# Altium schematic sheet Schema_2021-10-31.schdoc
size 344 x 344 mm
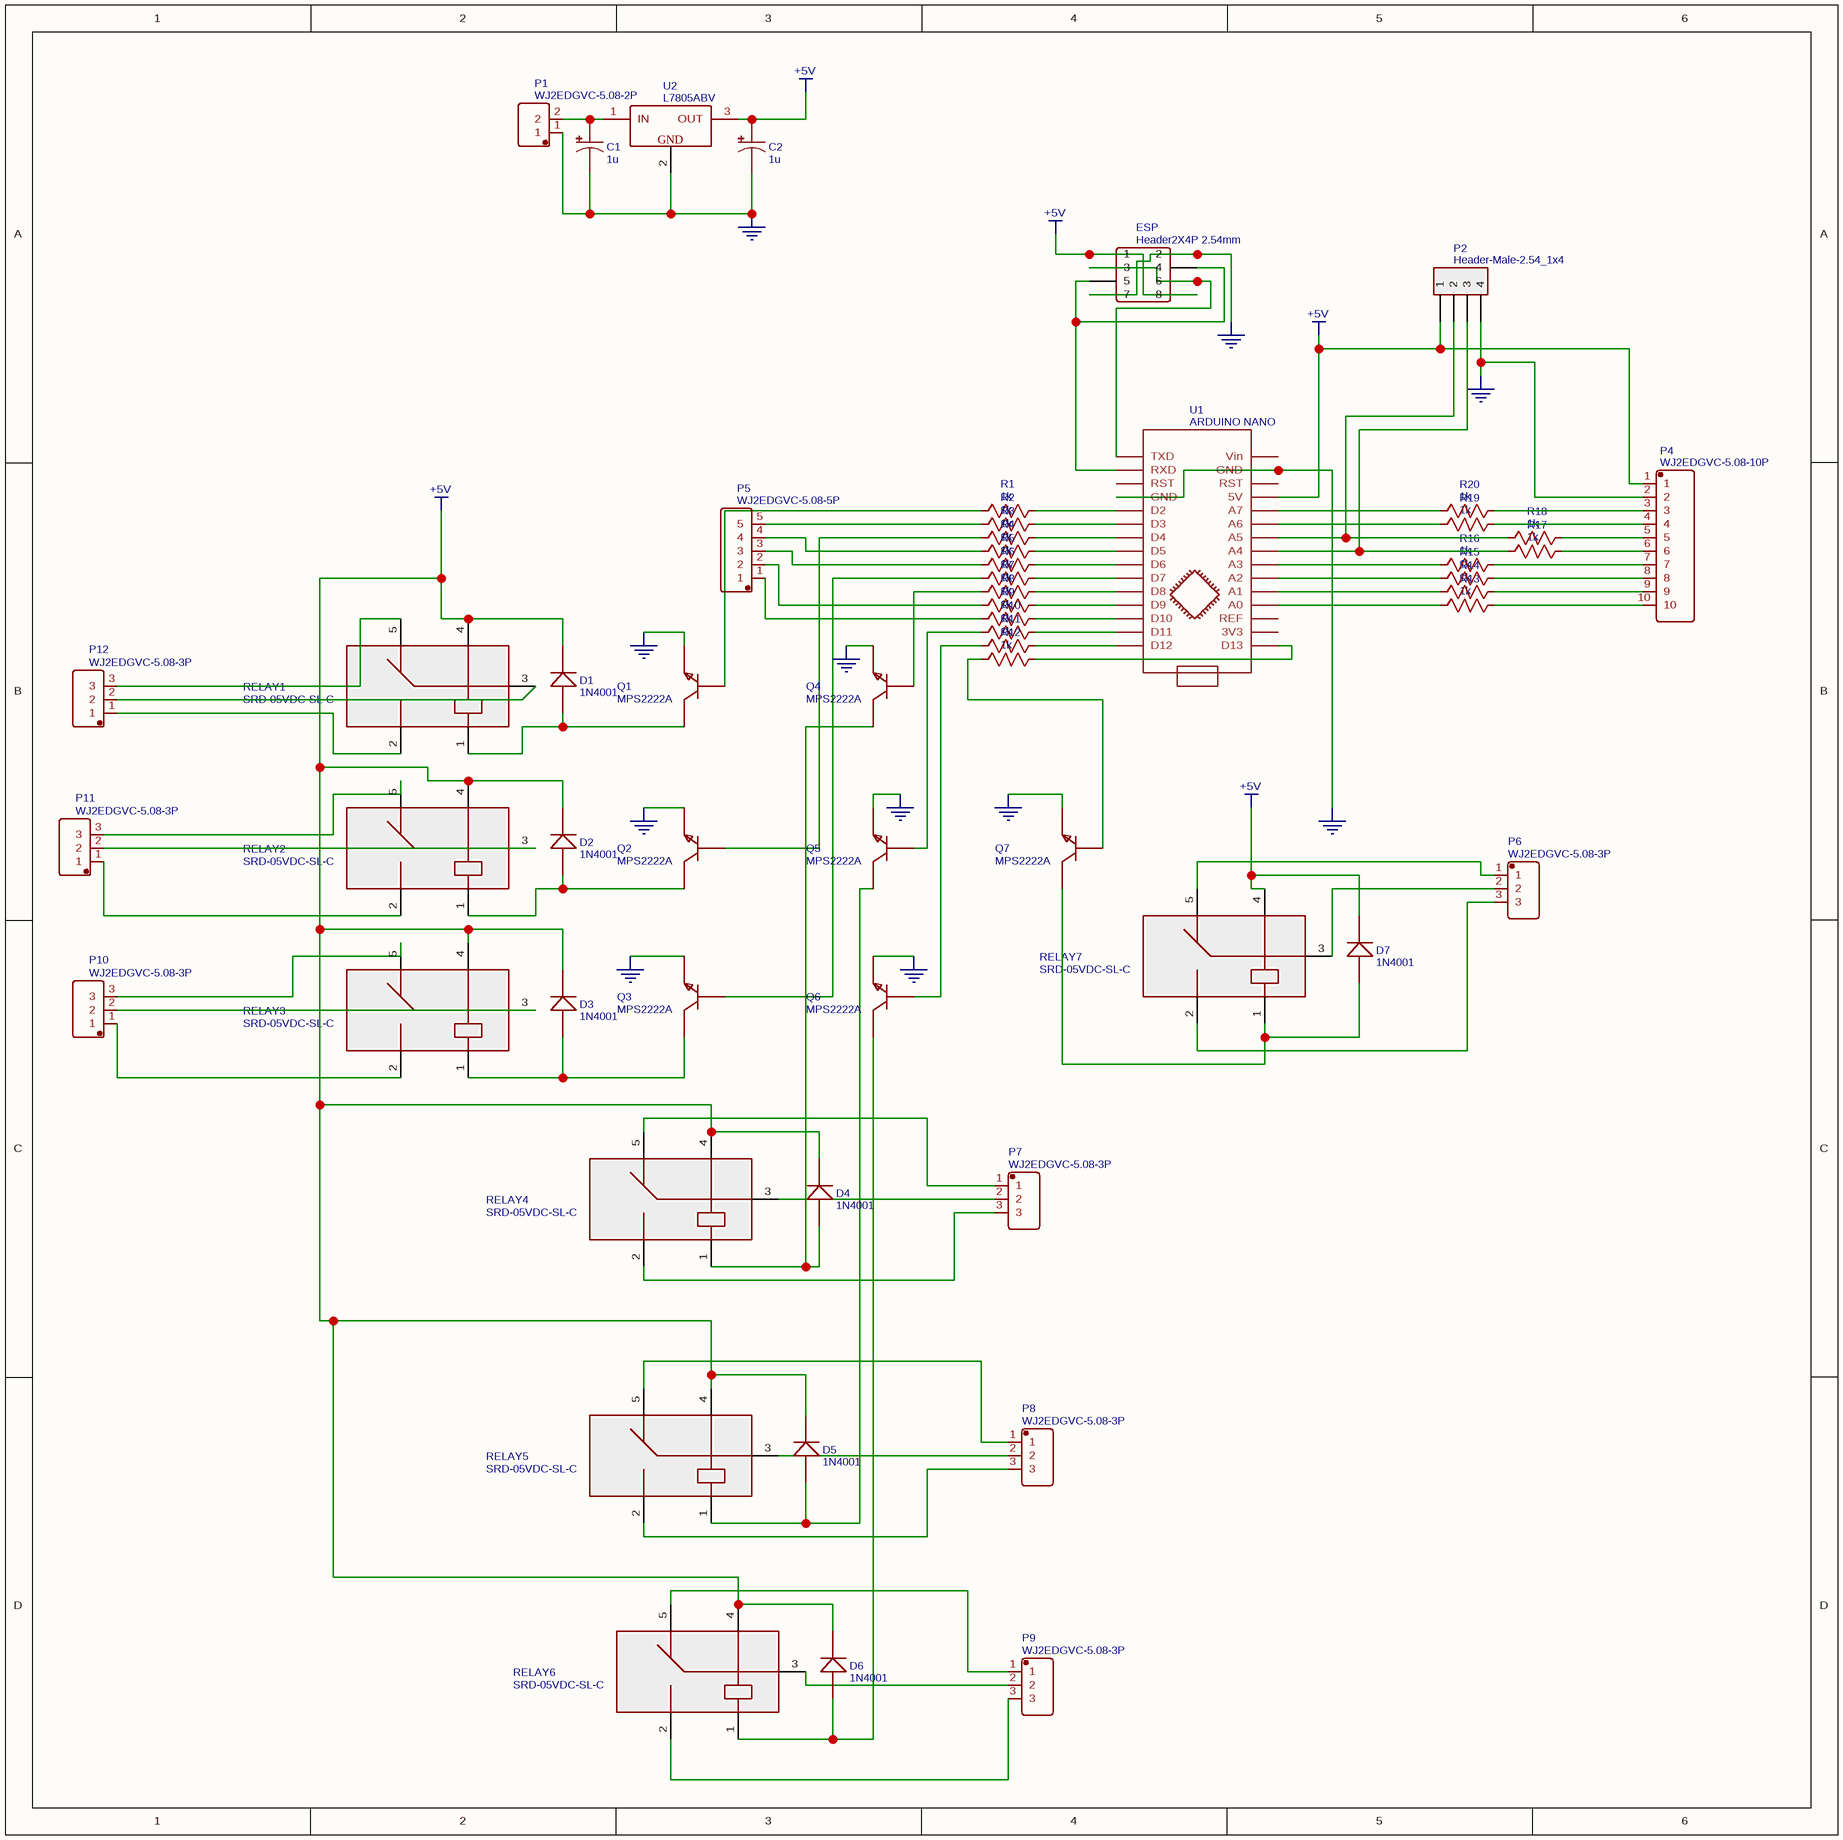
[diagram p0: Schema_2021-10-31.schdoc]

## Parts
C1  1u  [CAP-D5.0XF2.0]
C2  1u  [CAP-D5.0XF2.0]
D1  1N4001  [DO-41]
D2  1N4001  [DO-41]
D3  1N4001  [DO-41]
D4  1N4001  [DO-41]
D5  1N4001  [DO-41]
D6  1N4001  [DO-41]
D7  1N4001  [DO-41]
ESP  Header2X4P 2.54mm  [HDR-4X2/2.54]
P1  WJ2EDGVC-5.08-2P  [WJ2EDGVC-5.08-2P]
P2  Header-Male-2.54_1x4  [HDR-4X1/2.54]
P4  WJ2EDGVC-5.08-10P  [WJ2EDGVC-5.08-10P]
P5  WJ2EDGVC-5.08-5P  [WJ2EDGVC-5.08-5P]
P6  WJ2EDGVC-5.08-3P  [WJ2EDGVC-5.08-3P]
P7  WJ2EDGVC-5.08-3P  [WJ2EDGVC-5.08-3P]
P8  WJ2EDGVC-5.08-3P  [WJ2EDGVC-5.08-3P]
P9  WJ2EDGVC-5.08-3P  [WJ2EDGVC-5.08-3P]
P10  WJ2EDGVC-5.08-3P  [WJ2EDGVC-5.08-3P]
P11  WJ2EDGVC-5.08-3P  [WJ2EDGVC-5.08-3P]
P12  WJ2EDGVC-5.08-3P  [WJ2EDGVC-5.08-3P]
Q1  MPS2222A  [TO92-INLINE]
Q2  MPS2222A  [TO92-INLINE]
Q3  MPS2222A  [TO92-INLINE]
Q4  MPS2222A  [TO92-INLINE]
Q5  MPS2222A  [TO92-INLINE]
Q6  MPS2222A  [TO92-INLINE]
Q7  MPS2222A  [TO92-INLINE]
R1  1k  [0805]
R2  1k  [0805]
R3  1k  [0805]
R4  1k  [0805]
R5  1k  [0805]
R6  1k  [0805]
R7  1k  [0805]
R8  1k  [0805]
R9  1k  [0805]
R10  1k  [0805]
R11  1k  [0805]
R12  1k  [0805]
R13  1k  [0805]
R14  1k  [0805]
R15  1k  [0805]
R16  1k  [0805]
R17  1k  [0805]
R18  1k  [0805]
R19  1k  [0805]
R20  1k  [0805]
RELAY1  SRD-05VDC-SL-C  [RELAY-SL-SRD]
RELAY2  SRD-05VDC-SL-C  [RELAY-SL-SRD]
RELAY3  SRD-05VDC-SL-C  [RELAY-SL-SRD]
RELAY4  SRD-05VDC-SL-C  [RELAY-SL-SRD]
RELAY5  SRD-05VDC-SL-C  [RELAY-SL-SRD]
RELAY6  SRD-05VDC-SL-C  [RELAY-SL-SRD]
RELAY7  SRD-05VDC-SL-C  [RELAY-SL-SRD]
U1  ARDUINO NANO  [ARDUINO NANO]
U2  L7805ABV  [TO-220(TO-220-3)]

## Nets
+5V: C2.1 D1.2(K) D2.2(K) D3.2(K) D4.2(K) D5.2(K) D6.2(K) D7.2(K) ESP.1 ESP.8 P2.1 P4.1 P6.2 RELAY1.4 RELAY2.4 RELAY3.4 RELAY4.4 RELAY5.4 RELAY6.4 RELAY7.3 RELAY7.4 U1.27(5V) U2.3(OUT)
GND: C1.2 C2.2 ESP.2 ESP.7 P1.1 P2.4 P4.2 Q1.1(E) Q2.1(E) Q3.1(E) Q4.1(E) Q5.1(E) Q6.1(E) Q7.1(E) U1.4(GND) U1.29(GND) U2.2(GND)
NetC1_1: C1.1 P1.2 U2.1(IN)
NetD1_1: D1.1(A) Q1.3(C) RELAY1.1
NetD2_1: D2.1(A) Q2.3(C) RELAY2.1
NetD3_1: D3.1(A) Q3.3(C) RELAY3.1
NetD4_1: D4.1(A) Q4.3(C) RELAY4.1
NetD5_1: D5.1(A) Q5.3(C) RELAY5.1
NetD6_1: D6.1(A) Q6.3(C) RELAY6.1
NetD7_1: D7.1(A) Q7.3(C) RELAY7.1
NetESP_3: ESP.3 ESP.6 U1.1(TXD)
NetESP_4: ESP.4 ESP.5 U1.2(RXD)
NetP2_2: P2.2 R18.1 U1.24(A5)
NetP2_3: P2.3 R17.1 U1.23(A4)
NetP4_3: P4.3 R20.2
NetP4_4: P4.4 R19.2
NetP4_5: P4.5 R18.2
NetP4_6: P4.6 R17.2
NetP4_7: P4.7 R16.2
NetP4_8: P4.8 R15.2
NetP4_9: P4.9 R14.2
NetP4_10: P4.10 R13.2
NetP5_1: P5.1 R9.1
NetP5_2: P5.2 R8.1
NetP5_3: P5.3 R5.1
NetP5_4: P5.4 R4.1
NetP5_5: P5.5 R2.1
NetP6_1: P6.1 RELAY7.5
NetP6_3: P6.3 RELAY7.2
NetP7_1: P7.1 RELAY4.5
NetP7_2: P7.2 RELAY4.3
NetP7_3: P7.3 RELAY4.2
NetP8_1: P8.1 RELAY5.5
NetP8_2: P8.2 RELAY5.3
NetP8_3: P8.3 RELAY5.2
NetP9_1: P9.1 RELAY6.5
NetP9_2: P9.2 RELAY6.3
NetP9_3: P9.3 RELAY6.2
NetP10_1: P10.1 RELAY3.2
NetP10_2: P10.2 RELAY3.3
NetP10_3: P10.3 RELAY3.5
NetP11_1: P11.1 RELAY2.2
NetP11_2: P11.2 RELAY2.3
NetP11_3: P11.3 RELAY2.5
NetP12_1: P12.1 RELAY1.2
NetP12_2: P12.2 RELAY1.3
NetP12_3: P12.3 RELAY1.5
NetQ1_2: Q1.2(B) R1.1
NetQ2_2: Q2.2(B) R3.1
NetQ3_2: Q3.2(B) R6.1
NetQ4_2: Q4.2(B) R7.1
NetQ5_2: Q5.2(B) R10.1
NetQ6_2: Q6.2(B) R11.1
NetQ7_2: Q7.2(B) R12.1
NetR1_2: R1.2 U1.5(D2)
NetR2_2: R2.2 U1.6(D3)
NetR3_2: R3.2 U1.7(D4)
NetR4_2: R4.2 U1.8(D5)
NetR5_2: R5.2 U1.9(D6)
NetR6_2: R6.2 U1.10(D7)
NetR7_2: R7.2 U1.11(D8)
NetR8_2: R8.2 U1.12(D9)
NetR9_2: R9.2 U1.13(D10)
NetR10_2: R10.2 U1.14(D11)
NetR11_2: R11.2 U1.15(D12)
NetR12_2: R12.2 U1.16(D13)
NetR13_1: R13.1 U1.19(A0)
NetR14_1: R14.1 U1.20(A1)
NetR15_1: R15.1 U1.21(A2)
NetR16_1: R16.1 U1.22(A3)
NetR19_1: R19.1 U1.25(A6)
NetR20_1: R20.1 U1.26(A7)

Not connected (* = marked no-connect by the designer): U1 3(RST) 17(3V3) 18(REF) 28(RST) 30(Vin)

## Library data of the parts
C1 C2 = 1u: nameAlias: Value(F); BOM_Manufacturer Part: ?; spicePre: C; spiceSymbolName: Capacitor
D1-D7 = 1N4001: catid: 20; description: 1.0 Ampere General Purpose Rectifier; BOM_Manufacturer Part: ?; spicePre: D
ESP = Header2X4P 2.54mm: BOM_Manufacturer: ReliaPro; BOM_Supplier: LCSC; BOM_Manufacturer Part: Header2X4P 2.54mm; image: http://image.lceda.cn/szlcsc/C58363.jpg; spicePre: P; BOM_Supplier Part: undefined
P2 = Header-Male-2.54_1x4: BOM_Manufacturer: LCSC; BOM_Supplier: LCSC; BOM_Manufacturer Part: Header-Male-2.54_1x4; spicePre: P; BOM_Supplier Part: C59481
Q1-Q7 = MPS2222A: catid: 20; description: General Purpose Transistor NPN Silicon; BOM_Manufacturer Part: ?; spicePre: Q
R1-R20 = 1k: nameAlias: Value(Ω); BOM_Manufacturer Part: ?; spicePre: R; spiceSymbolName: Resistor
RELAY1-RELAY7 = SRD-05VDC-SL-C: BOM_Manufacturer: LCSC; BOM_Supplier: LCSC; BOM_Manufacturer Part: SRD-05VDC-SL-C; spicePre: R; BOM_Supplier Part: C35449
U1 = ARDUINO NANO: catid: 20; sourceId: g2wyehQ7j; timeStamp: 1474998353; BOM_Manufacturer Part: ?; spicePre: U
U2 = L7805ABV: BOM_Manufacturer: ST; catid: 20; BOM_Supplier: LCSC; BOM_Manufacturer Part: L7805ABV; spicePre: U; BOM_Supplier Part: C16807
P1 = WJ2EDGVC-5.08-2P: spicePre: X; BOM_Supplier: LCSC; BOM_Manufacturer Part: ?; BOM_Supplier Part: C8445
P4 = WJ2EDGVC-5.08-10P: spicePre: X; BOM_Supplier: LCSC; BOM_Manufacturer Part: ?; BOM_Supplier Part: C29173
P5 = WJ2EDGVC-5.08-5P: spicePre: X; BOM_Supplier: LCSC; BOM_Manufacturer Part: ?; BOM_Supplier Part: C8423
P6-P12 = WJ2EDGVC-5.08-3P: spicePre: X; BOM_Supplier: LCSC; BOM_Manufacturer Part: ?; BOM_Supplier Part: C8430